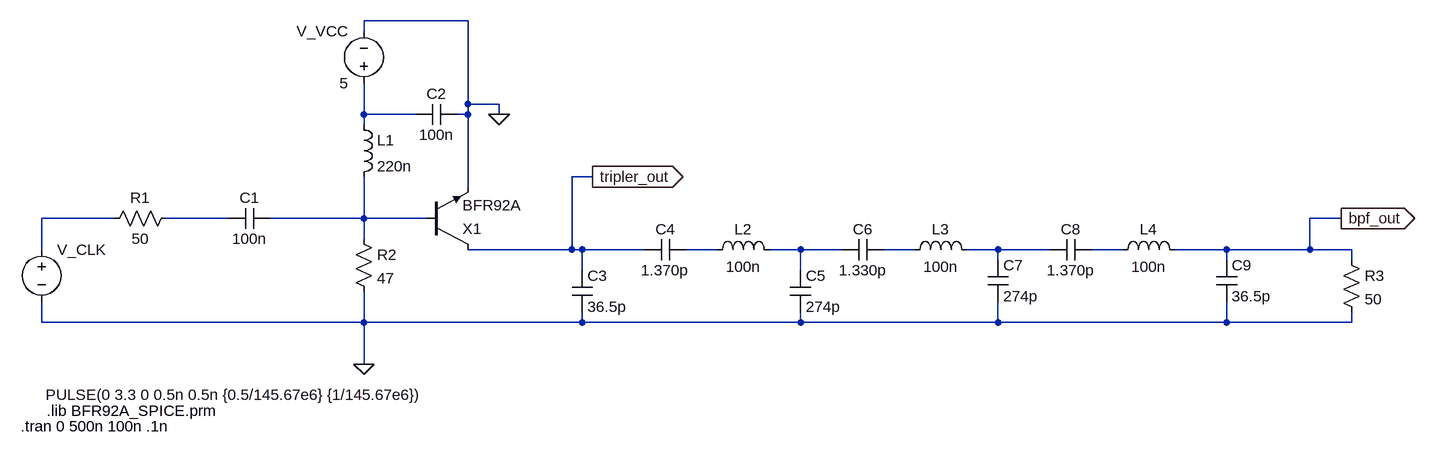
[diagram p0: schematic tripler_with_BPF_v02.asc]
tripler_with_BPF_v02.asc, the LTspice schematic file:
Version 4.1
SHEET 1 1944 680
WIRE 448 -96 288 -96
WIRE 288 -80 288 -96
WIRE 448 32 448 -96
WIRE 496 32 448 32
WIRE 288 48 288 0
WIRE 368 48 288 48
WIRE 448 48 448 32
WIRE 448 48 432 48
WIRE 496 48 496 32
WIRE 288 64 288 48
WIRE 640 144 608 144
WIRE 448 160 448 48
WIRE -96 208 -208 208
WIRE 80 208 -16 208
WIRE 288 208 288 144
WIRE 288 208 144 208
WIRE 384 208 288 208
WIRE 1792 208 1744 208
WIRE 288 240 288 208
WIRE -208 256 -208 208
WIRE 608 256 608 144
WIRE 608 256 448 256
WIRE 624 256 608 256
WIRE 720 256 624 256
WIRE 832 256 784 256
WIRE 960 256 912 256
WIRE 1024 256 960 256
WIRE 1136 256 1088 256
WIRE 1264 256 1216 256
WIRE 1344 256 1264 256
WIRE 1456 256 1408 256
WIRE 1616 256 1536 256
WIRE 1744 256 1744 208
WIRE 1744 256 1616 256
WIRE 1808 256 1744 256
WIRE 1264 272 1264 256
WIRE 1616 272 1616 256
WIRE 1808 272 1808 256
WIRE 624 288 624 256
WIRE 960 288 960 256
WIRE -208 368 -208 336
WIRE 288 368 288 320
WIRE 288 368 -208 368
WIRE 624 368 624 352
WIRE 624 368 288 368
WIRE 960 368 960 352
WIRE 960 368 624 368
WIRE 1264 368 1264 336
WIRE 1264 368 960 368
WIRE 1616 368 1616 336
WIRE 1616 368 1264 368
WIRE 1808 368 1808 352
WIRE 1808 368 1616 368
WIRE 288 432 288 368
FLAG 496 48 0
FLAG 288 432 0
FLAG 640 144 tripler_out
IOPIN 640 144 Out
FLAG 1792 208 bpf_out
IOPIN 1792 208 Out
SYMBOL voltage -208 240 R0
WINDOW 3 6 239 Left 2
WINDOW 123 0 0 Left 0
WINDOW 39 0 0 Left 0
SYMATTR Value PULSE(0 3.3 0 0.5n 0.5n {0.5/145.67e6} {1/145.67e6})
SYMATTR InstName V_CLK
SYMBOL res 0 192 R90
WINDOW 0 0 56 VBottom 2
WINDOW 3 32 56 VTop 2
SYMATTR InstName R1
SYMATTR Value 50
SYMBOL cap 144 192 R90
WINDOW 0 0 32 VBottom 2
WINDOW 3 32 32 VTop 2
SYMATTR InstName C1
SYMATTR Value 100n
SYMBOL voltage 288 16 R180
WINDOW 0 24 96 Left 2
WINDOW 3 24 16 Left 2
WINDOW 123 0 0 Left 0
WINDOW 39 0 0 Left 0
SYMATTR InstName V_VCC
SYMATTR Value 5
SYMBOL ind 272 48 R0
SYMATTR InstName L1
SYMATTR Value 220n
SYMBOL res 272 224 R0
SYMATTR InstName R2
SYMATTR Value 47
SYMBOL cap 432 32 R90
WINDOW 0 0 32 VBottom 2
WINDOW 3 32 32 VTop 2
SYMATTR InstName C2
SYMATTR Value 100n
SYMBOL npn 384 256 M180
SYMATTR InstName X1
SYMATTR Value BFR92A
SYMATTR Prefix X
SYMBOL res 1792 256 R0
SYMATTR InstName R3
SYMATTR Value 50
SYMBOL cap 608 288 R0
SYMATTR InstName C3
SYMATTR Value 36.5p
SYMBOL cap 784 240 R90
WINDOW 0 0 32 VBottom 2
WINDOW 3 32 32 VTop 2
SYMATTR InstName C4
SYMATTR Value 1.370p
SYMBOL ind 816 272 R270
WINDOW 0 32 56 VTop 2
WINDOW 3 5 56 VBottom 2
SYMATTR InstName L2
SYMATTR Value 100n
SYMBOL cap 944 288 R0
SYMATTR InstName C5
SYMATTR Value 274p
SYMBOL cap 1088 240 R90
WINDOW 0 0 32 VBottom 2
WINDOW 3 32 32 VTop 2
SYMATTR InstName C6
SYMATTR Value 1.330p
SYMBOL ind 1120 272 R270
WINDOW 0 32 56 VTop 2
WINDOW 3 5 56 VBottom 2
SYMATTR InstName L3
SYMATTR Value 100n
SYMBOL cap 1248 272 R0
SYMATTR InstName C7
SYMATTR Value 274p
SYMBOL cap 1408 240 R90
WINDOW 0 0 32 VBottom 2
WINDOW 3 32 32 VTop 2
SYMATTR InstName C8
SYMATTR Value 1.370p
SYMBOL ind 1440 272 R270
WINDOW 0 32 56 VTop 2
WINDOW 3 5 56 VBottom 2
SYMATTR InstName L4
SYMATTR Value 100n
SYMBOL cap 1600 272 R0
SYMATTR InstName C9
SYMATTR Value 36.5p
TEXT -200 504 Left 2 !.lib BFR92A_SPICE.prm
TEXT -240 528 Left 2 !.tran 0 500n 100n .1n

The netlist it stands for:
* tripler_with_BPF_v02.asc
V_CLK N002 0 PULSE(0 3.3 0 0.5n 0.5n {0.5/145.67e6} {1/145.67e6})
R1 N003 N002 50
C1 N004 N003 100n
V_VCC N001 0 5
L1 N001 N004 220n
R2 N004 0 47
C2 0 N001 100n
X§X1 tripler_out N004 0 BFR92A  ; pins C B E
R3 bpf_out 0 50
C3 tripler_out 0 36.5p
C4 N005 tripler_out 1.370p
L2 N005 N006 100n
C5 N006 0 274p
C6 N007 N006 1.330p
L3 N007 N008 100n
C7 N008 0 274p
C8 N009 N008 1.370p
L4 N009 bpf_out 100n
C9 bpf_out 0 36.5p
.lib BFR92A_SPICE.prm
.tran 0 500n 100n .1n
.backanno
.end